# Altium schematic sheet Sheet5.SchDoc
size A4
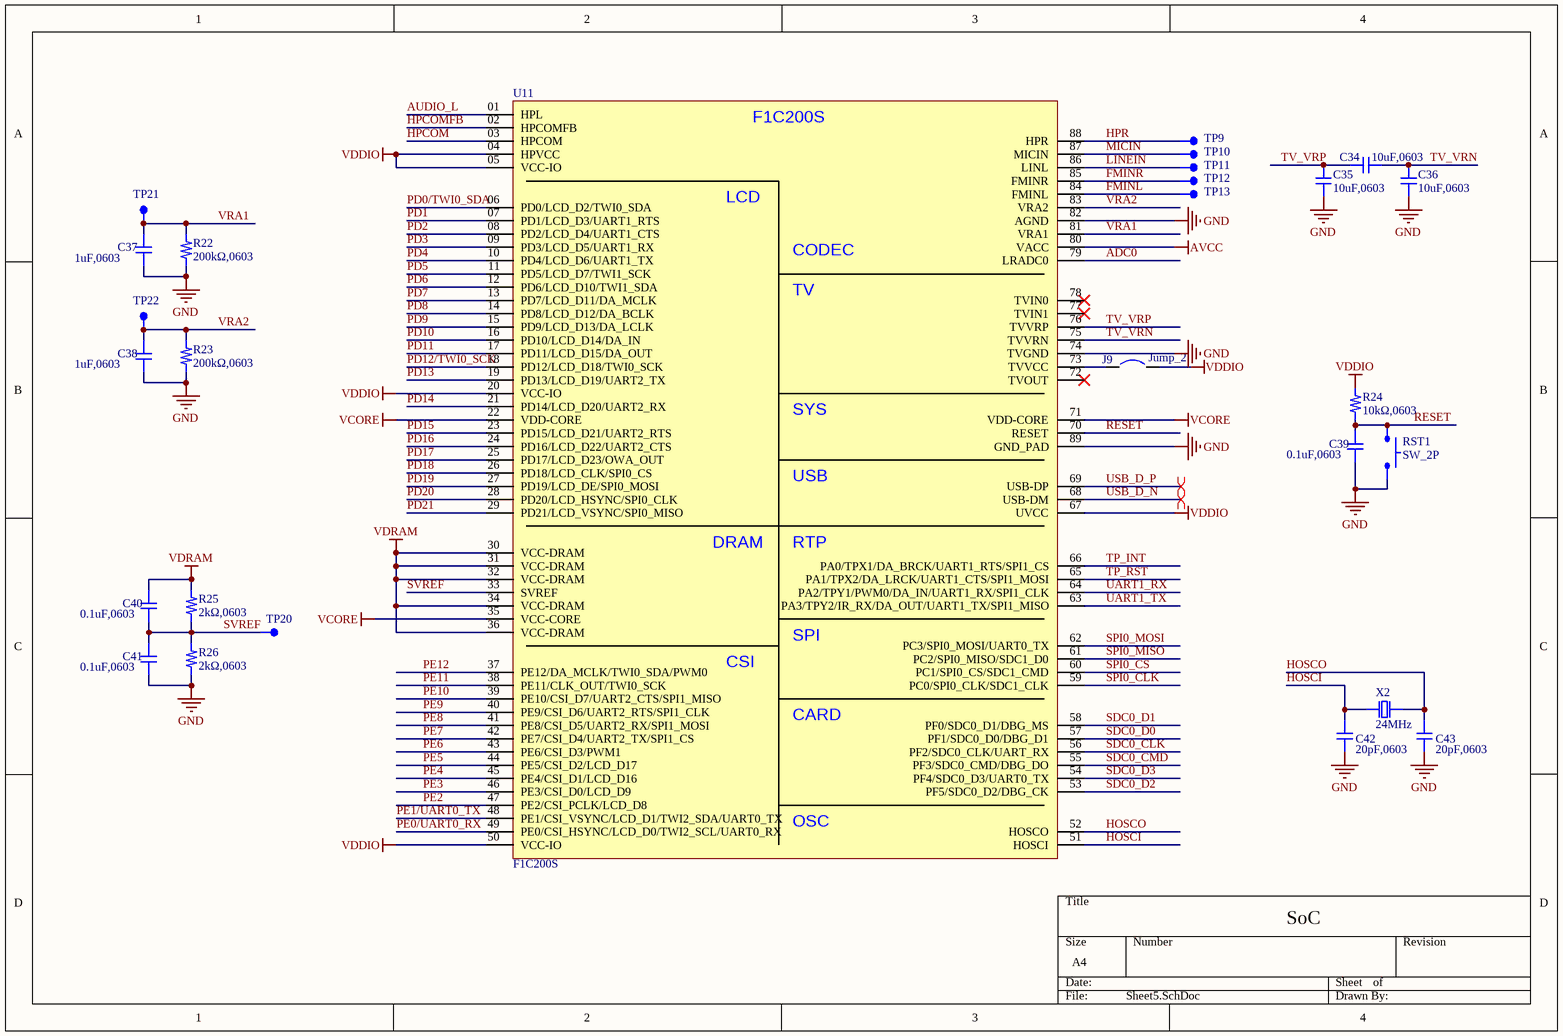
[diagram p0: Sheet5.SchDoc]

## Parts
C34  10uF,0603  [C0603]
C35  10uF,0603  [C0603]
C36  10uF,0603  [C0603]
C37  1uF,0603  [C0603]
C38  1uF,0603  [C0603]
C39  0.1uF,0603  [C0603]
C40  0.1uF,0603  [C0603]
C41  0.1uF,0603  [C0603]
C42  20pF,0603  [C0603]
C43  20pF,0603  [C0603]
J9  Jump_2  [Jp_small]
R22  200kΩ,0603  [R0603]
R23  200kΩ,0603  [R0603]
R24  10kΩ,0603  [R0603]
R25  2kΩ,0603  [R0603]
R26  2kΩ,0603  [R0603]
RST1  SW_2P  [SW_2P_4]
TP9  TP  [TP]  (value not drawn)
TP10  TP  [TP]  (value not drawn)
TP11  TP  [TP]  (value not drawn)
TP12  TP  [TP]  (value not drawn)
TP13  TP  [TP]  (value not drawn)
TP20  TP  [TP]  (value not drawn)
TP21  TP  [TP]  (value not drawn)
TP22  TP  [TP]  (value not drawn)
U11  F1C200S  [MQFN_10_10_v3]
X2  24MHz  [XTAL_SMD_3225]

## Nets
AVCC: U11.80(VACC)
GND: C35.02 C36.02 C37.01 C38.01 C39.01 C41.01 C42.01 C43.01 R22.02 R23.02 R26.02 RST1.02 U11.74(TVGND) U11.82(AGND) U11.89(GND_PAD)
VCORE: U11.22(VDD-CORE) U11.35(VCC-CORE) U11.71(VDD-CORE)
VDDIO: J9.02 R24.01 U11.04(HPVCC) U11.05(VCC-IO) U11.20(VCC-IO) U11.50(VCC-IO) U11.67(UVCC)
VDRAM: C40.02 R25.01 U11.30(VCC-DRAM) U11.31(VCC-DRAM) U11.32(VCC-DRAM) U11.34(VCC-DRAM) U11.36(VCC-DRAM)
ADC0: U11.79(LRADC0)
AUDIO_L: U11.01(HPL)
FMINL: TP13.01 U11.84(FMINL)
FMINR: TP12.01 U11.85(FMINR)
HOSCI: C42.02 U11.51(HOSCI) X2.01
HOSCO: C43.02 U11.52(HOSCO) X2.02
HPCOM: U11.03(HPCOM)
HPCOMFB: U11.02(HPCOMFB)
HPR: TP9.01 U11.88(HPR)
LINEIN: TP11.01 U11.86(LINL)
MICIN: TP10.01 U11.87(MICIN)
PD0/TWI0_SDA: U11.06(PD0/LCD_D2/TWI0_SDA)
PD1: U11.07(PD1/LCD_D3/UART1_RTS)
PD2: U11.08(PD2/LCD_D4/UART1_CTS)
PD3: U11.09(PD3/LCD_D5/UART1_RX)
PD4: U11.10(PD4/LCD_D6/UART1_TX)
PD5: U11.11(PD5/LCD_D7/TWI1_SCK)
PD6: U11.12(PD6/LCD_D10/TWI1_SDA)
PD7: U11.13(PD7/LCD_D11/DA_MCLK)
PD8: U11.14(PD8/LCD_D12/DA_BCLK)
PD9: U11.15(PD9/LCD_D13/DA_LCLK)
PD10: U11.16(PD10/LCD_D14/DA_IN)
PD11: U11.17(PD11/LCD_D15/DA_OUT)
PD12/TWI0_SCK: U11.18(PD12/LCD_D18/TWI0_SCK)
PD13: U11.19(PD13/LCD_D19/UART2_TX)
PD14: U11.21(PD14/LCD_D20/UART2_RX)
PD15: U11.23(PD15/LCD_D21/UART2_RTS)
PD16: U11.24(PD16/LCD_D22/UART2_CTS)
PD17: U11.25(PD17/LCD_D23/OWA_OUT)
PD18: U11.26(PD18/LCD_CLK/SPI0_CS)
PD19: U11.27(PD19/LCD_DE/SPI0_MOSI)
PD20: U11.28(PD20/LCD_HSYNC/SPI0_CLK)
PD21: U11.29(PD21/LCD_VSYNC/SPI0_MISO)
PE0/UART0_RX: U11.49(PE0/CSI_HSYNC/LCD_D0/TWI2_SCL/UART0_RX)
PE1/UART0_TX: U11.48(PE1/CSI_VSYNC/LCD_D1/TWI2_SDA/UART0_TX)
PE2: U11.47(PE2/CSI_PCLK/LCD_D8)
PE3: U11.46(PE3/CSI_D0/LCD_D9)
PE4: U11.45(PE4/CSI_D1/LCD_D16)
PE5: U11.44(PE5/CSI_D2/LCD_D17)
PE6: U11.43(PE6/CSI_D3/PWM1)
PE7: U11.42(PE7/CSI_D4/UART2_TX/SPI1_CS)
PE8: U11.41(PE8/CSI_D5/UART2_RX/SPI1_MOSI)
PE9: U11.40(PE9/CSI_D6/UART2_RTS/SPI1_CLK)
PE10: U11.39(PE10/CSI_D7/UART2_CTS/SPI1_MISO)
PE11: U11.38(PE11/CLK_OUT/TWI0_SCK)
PE12: U11.37(PE12/DA_MCLK/TWI0_SDA/PWM0)
RESET: C39.02 R24.02 RST1.01 U11.70(RESET)
SDC0_CLK: U11.56(PF2/SDC0_CLK/UART_RX)
SDC0_CMD: U11.55(PF3/SDC0_CMD/DBG_DO)
SDC0_D0: U11.57(PF1/SDC0_D0/DBG_D1)
SDC0_D1: U11.58(PF0/SDC0_D1/DBG_MS)
SDC0_D2: U11.53(PF5/SDC0_D2/DBG_CK)
SDC0_D3: U11.54(PF4/SDC0_D3/UART0_TX)
SPI0_CLK: U11.59(PC0/SPI0_CLK/SDC1_CLK)
SPI0_CS: U11.60(PC1/SPI0_CS/SDC1_CMD)
SPI0_MISO: U11.61(PC2/SPI0_MISO/SDC1_D0)
SPI0_MOSI: U11.62(PC3/SPI0_MOSI/UART0_TX)
SVREF: C40.01 C41.02 R25.02 R26.01 TP20.01 U11.33(SVREF)
TP_INT: U11.66(PA0/TPX1/DA_BRCK/UART1_RTS/SPI1_CS)
TP_RST: U11.65(PA1/TPX2/DA_LRCK/UART1_CTS/SPI1_MOSI)
TV_VRN: C34.01 C36.01 U11.75(TVVRN)
TV_VRP: C34.02 C35.01 U11.76(TVVRP)
UART1_RX: U11.64(PA2/TPY1/PWM0/DA_IN/UART1_RX/SPI1_CLK)
UART1_TX: U11.63(PA3/TPY2/IR_RX/DA_OUT/UART1_TX/SPI1_MISO)
USB_D_N: U11.68(USB-DM)
USB_D_P: U11.69(USB-DP)
VRA1: C37.02 R22.01 TP21.01 U11.81(VRA1)
VRA2: C38.02 R23.01 TP22.01 U11.83(VRA2)
NetJ9_01: J9.01 U11.73(TVVCC)

Not connected (* = marked no-connect by the designer): U11 72(TVOUT)* 77(TVIN1)* 78(TVIN0)*

## Layout directives
differential pair: USB_D_N, USB_D_P

## Notes on the sheet
- SoC
- (in symbol F1C200S) LCD; CODEC; TV; SYS; USB; DRAM; RTP; SPI; CSI; CARD; OSC

## Library data of the parts
C34-C43 = Cap
R22-R26 = Res
X2 = XTAL